# Altium schematic sheet RF.SchDoc
size A4; SheetNumber: 4; SheetTotal: 4
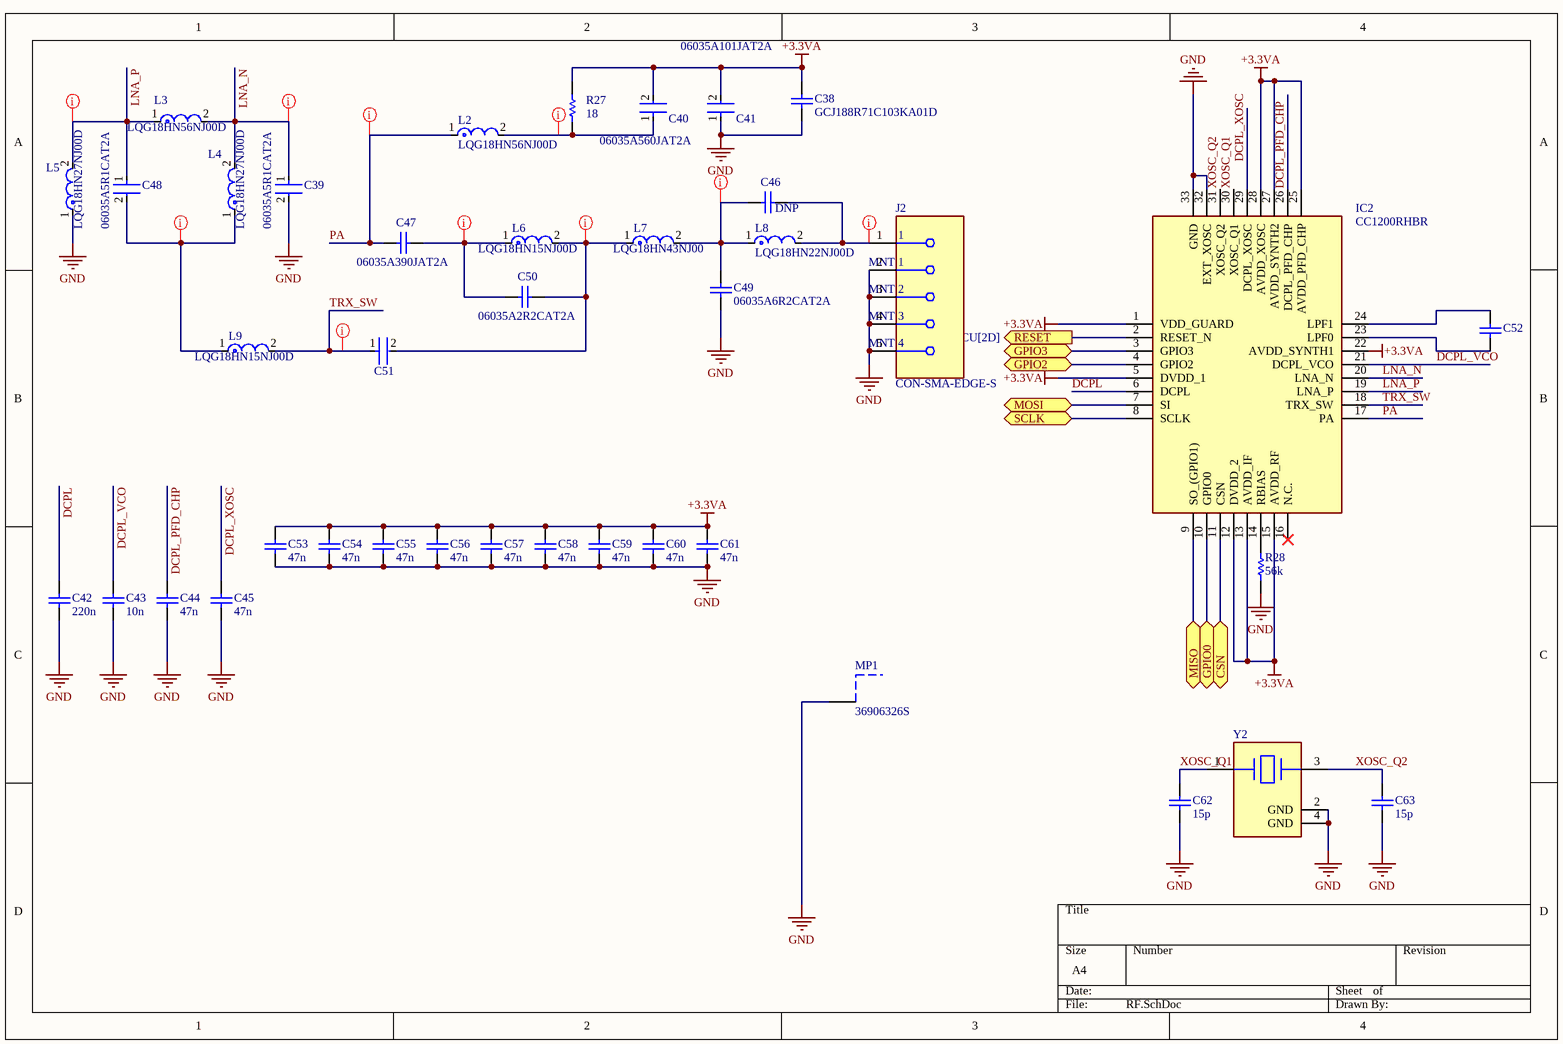
[diagram p0: RF.SchDoc]

## Parts
C38  GCJ188R71C103KA01D  [CAPC1608X90X35LL10T15]
C39  06035A5R1CAT2A  [FP-GCM188-0_1-IPC_A]
C40  06035A560JAT2A  [FP-GCM188-0_1-IPC_A]
C41  06035A101JAT2A  [FP-GCM188-0_1-IPC_A]
C42  value 220n  [RES_0805]  (hidden comment: Capacitor)
C43  value 10n  [RES_0805]  (hidden comment: Capacitor)
C44  value 47n  [RES_0805]  (hidden comment: Capacitor)
C45  value 47n  [RES_0805]  (hidden comment: Capacitor)
C46  DNP  [CAPC1608X90X35LL15T15]
C47  06035A390JAT2A  [CAPC1608X90X35LL15T15]
C48  06035A5R1CAT2A  [FP-GCM188-0_1-IPC_A]
C49  06035A6R2CAT2A  [CAPC1608X90X35LL15T15]
C50  06035A2R2CAT2A  [CAPC1608X90X35LL15T15]
C51  06035A5R1CAT2A  [FP-GCM188-0_1-IPC_A]  (value not drawn)
C52  GCM188R71H152KA37D  [CAPC1608X90X35LL10T15]  (value not drawn)
C53  value 47n  [RES_0805]  (hidden comment: Capacitor)
C54  value 47n  [RES_0805]  (hidden comment: Capacitor)
C55  value 47n  [RES_0805]  (hidden comment: Capacitor)
C56  value 47n  [RES_0805]  (hidden comment: Capacitor)
C57  value 47n  [RES_0805]  (hidden comment: Capacitor)
C58  value 47n  [RES_0805]  (hidden comment: Capacitor)
C59  value 47n  [RES_0805]  (hidden comment: Capacitor)
C60  value 47n  [RES_0805]  (hidden comment: Capacitor)
C61  value 47n  [RES_0805]  (hidden comment: Capacitor)
C62  value 15p  [RES_0805]  (hidden comment: Capacitor)
C63  value 15p  [RES_0805]  (hidden comment: Capacitor)
IC2  CC1200RHBR  [QFN50P500X500X100-33N-D]
J2  CON-SMA-EDGE-S  [FP-CON-SMA-EDGE-S-MFG]
L2  LQG18HN56NJ00D  [FP-LQG18HH_00-IPC_A]
L3  LQG18HN56NJ00D  [FP-LQG18HH_00-IPC_A]
L4  LQG18HN27NJ00D  [FP-LQG18HH_00-MFG]
L5  LQG18HN27NJ00D  [FP-LQG18HH_00-MFG]
L6  LQG18HN15NJ00D  [FP-LQG18HH_00-IPC_C]
L7  LQG18HN43NJ00  [FP-LQG18HH_00-IPC_C]
L8  LQG18HN22NJ00D  [FP-LQG18HH_00-IPC_C]
L9  LQG18HN15NJ00D  [FP-LQG18HH_00-IPC_C]
MP1  36906326S  [36906326S]
R27  value 18  [RES_0805]  (hidden comment: Resistor)
R28  value 56k  [RES_0805]  (hidden comment: Resistor)
Y2  NX3225SA-40.000MHZ-STD-CSR-1 NDK  [FP-ABM8G-MFG]  (value not drawn)

## Ports
CSN (bidir, see MCU[2D]), GPIO0 (bidir, see MCU[2D]), GPIO2 (bidir, see MCU[2D]), GPIO3 (bidir, see MCU[2D]), MISO (bidir, see MCU[2D]), MOSI (bidir, see MCU[2D]), RESET (out, see MCU[2D]), SCLK (bidir, see MCU[2D])

## Nets
+3.3VA: C38.2 C40.2 C41.2 C53.1 C54.1 C55.1 C56.1 C57.1 C58.1 C59.1 C60.1 C61.1 IC2.1(VDD_GUARD) IC2.5(DVDD_1) IC2.12(DVDD_2) IC2.13(AVDD_IF) IC2.15(AVDD_RF) IC2.22(AVDD_SYNTH1) IC2.25(AVDD_PFD_CHP) IC2.27(AVDD_SYNTH2) IC2.28(AVDD_XOSC) R27.1
GND: C38.1 C39.2 C41.1 C42.2 C43.2 C44.2 C45.2 C49.1 C53.2 C54.2 C55.2 C56.2 C57.2 C58.2 C59.2 C60.2 C61.2 C62.2 C63.2 IC2.32(EXT_XOSC) IC2.33(GND) J2.2(MNT_1) J2.3(MNT_2) J2.4(MNT_3) J2.5(MNT_4) L5.1 MP1.1 R28.2 Y2.2(GND) Y2.4(GND)
CSN: IC2.11(CSN) ; port CSN
DCPL: C42.1 IC2.6(DCPL)
DCPL_PFD_CHP: C44.1 IC2.26(DCPL_PFD_CHP)
DCPL_VCO: C43.1 IC2.21(DCPL_VCO)
DCPL_XOSC: C45.1 IC2.29(DCPL_XOSC)
GPIO0: IC2.10(GPIO0) ; port GPIO0
GPIO2: IC2.4(GPIO2) ; port GPIO2
GPIO3: IC2.3(GPIO3) ; port GPIO3
LNA_N: C39.1 IC2.20(LNA_N) L3.2 L4.2
LNA_P: C48.1 IC2.19(LNA_P) L3.1 L5.2
MISO: IC2.9(SO_(GPIO1)) ; port MISO
MOSI: IC2.7(SI) ; port MOSI
PA: C47.2 IC2.17(PA) L2.1
RESET: IC2.2(RESET_N) ; port RESET
SCLK: IC2.8(SCLK) ; port SCLK
TRX_SW: C51.1 IC2.18(TRX_SW) L9.2
XOSC_Q1: C62.1 IC2.30(XOSC_Q1) Y2.1
XOSC_Q2: C63.1 IC2.31(XOSC_Q2) Y2.3
NetC40_1: C40.1 L2.2 R27.2
NetC46_1: C46.1 J2.1 L8.2
NetC46_2: C46.2 C49.2 L7.2 L8.1
NetC47_1: C47.1 C50.2 L6.1
NetC48_2: C48.2 L4.1 L9.1
NetC50_1: C50.1 C51.2 L6.2 L7.1
NetC52_1: C52.1 IC2.23(LPF0)
NetC52_2: C52.2 IC2.24(LPF1)
NetIC2_14: IC2.14(RBIAS) R28.1

Not connected (* = marked no-connect by the designer): IC2 16(N.C.)*

## Layout directives
net class 50ohm: LNA_N, LNA_P, NetC40_1, NetC46_1, NetC46_2, NetC47_1, NetC48_2, NetC50_1, PA, TRX_SW

## Library data of the parts
C38 = CMP-2000-06338-1: Cap Ceramic 0.01uF 16V X7R 10% Pad SMD 0603 Soft Termination 125C Automotive T/R; Manufacturer: Murata; Capacitance: 10nF; Mounting Technology: SurfaceMount; Tolerance (%): ±10%; Case Size/Dimension: 0603; Datasheet URL: http://search.murata.co.jp/Ceramy/image/img/A01X/G101/ENG/GRM188R71C103KA01-01.pdf; Rated Voltage: 16V; Datasheet Version: 02/2016; Dielectric: X7R; Manufacturer URL: http://www.murata.com/; Package Reference: 0603; Package Description: 2-Pin Surface Mount Device, Body 1.6 x 0.8 mm
C39 C48 C51 = CMP-06035-052280-1: 0603 5.1 pF 50 V ±0.25 pF Tolerance C0G/NP0 Multilayer Ceramic Capacitor
C40 = CMP-06035-052280-1: 0603 56 pF 50 V ±5% Tolerance C0G/NP0 Surface Mount Multilayer Ceramic Capacitor
C41 = CMP-06035-052280-1: 0603 100 pF 50 V ±5% Tolerance C0G/NP0 SMT Multilayer Ceramic Capacitor
C42-C45 C53-C63 = Capacitor: SimulationGenericComponent: True
C46 C47 = CMP-2006-04354-1: Part Number: 06035A6R2CAT2A; Manufacturer: AVX Interconnect / Elco
C49 = CMP-2006-04354-1: Manufacturer: AVX Interconnect / Elco; Part Number: 06035A6R2CAT2A
C50 = CMP-2006-04354-1: 0603 2.2 pF 50 V ±0.25 pF Tolerance C0G/NP0 SMT Multilayer Ceramic Capacitor; Part Number: 06035A6R2CAT2A; Manufacturer: AVX Interconnect / Elco
C52 = CMP-2006-02377-1: Manufacturer: Murata; Part Number: GCM188R71H152KA37D
IC2 = CC1200RHBR: Integrated Circuit; Manufacturer_Name: Texas Instruments; Datasheet Link: http://www.ti.com/lit/gpn/cc1200; Height: 1mm; Manufacturer_Part_Number: CC1200RHBR; Mouser Part Number: 595-CC1200RHBR; Mouser Price/Stock: https://www.mouser.co.uk/ProductDetail/Texas-Instruments/CC1200RHBR?qs=R6c3TimDHSkfQr3ZZbsbuA%3D%3D; Arrow Part Number: CC1200RHBR; Arrow Price/Stock: https://www.arrow.com/en/products/cc1200rhbr/texas-instruments
J2 = CMP-204357-000001-1: CONN SMA JACK STR EDGE MNT; Manufacturer: RF Solutions Ltd.; Impedance: 50Ω; Conn Orientation: Right Angle; Is Female: yes; Number Of Contacts: 1; Frequency: 18GHz; Shielding: true; Category: Conn; ComponentLink2URL: https://www.rfsolutions.co.uk/downloads/1498648656DS-CON-EDGE-SMA-4.pdf; Octopart: https://octopart.com/con-sma-edge-s-rf+solutions-70967450; Package: CONN_JACK; Manufacturer Part Number: CON-SMA-EDGE-S; Height: 6.35mm; Device Class L1: Connectors; Footprint Url: https://forum.upverter.com/uploads/default/original/3X/b/e/be75b907af57498775929d6d9099689c472e0307.pdf; Contact Material: Gold; ComponentLink2Description: Datasheet; Device Class L2: RF / Coaxial Connectors; RoHS: TRUE; Device Class L3: unset; Digikey Description: CONN SMA JACK STR EDGE MNT; Lead Free: Yes; Automotive: No
L2 L3 = CMP-06042-002204-1: Multilayer type RF Inductor 56nH ±5% 0.75Ω 400mA 0603; DC Current: 300mA; DC Resistance (DCR): 750mR; Self Resonant Frequency: 1.1GHz; Test Frequency: 100MHz; Shielding: Unshielded; Q Factor: 12; Core Material: Air; Width: 0.031inch; Case Code (Metric): 1608; Inductance: 56nH; Mount: Surface Mount; Depth: 0.95mm; Max DC Current: 300mA; Case/Package: 0603; Length: 1.75mm; Case Code (Imperial): 0603; Military Standard: Not; Min Operating Temperature: -40°C; Lead Free: Lead Free; Packaging: Tape and Reel; Radiation Hardening: No; Max Operating Temperature: 85°C; Termination: SMD/SMT; Tolerance: 5%; Current Rating: 300mA; Package Quantity: 1; Height: 0.031inch
L4 L5 = CMP-06042-005497-1: Multilayer type RF Inductor 27nH ±5% 0.54Ω 500mA 0603; Q Factor: 12; Shielding: Unshielded; Max DC Current: 300mA; Self Resonant Frequency: 2GHz; Test Frequency: 100MHz; Core Material: Air; DC Resistance (DCR): 550mR; Min Operating Temperature: -55°C; Max Operating Temperature: 85°C; Tolerance: 5%; Depth: 0.95mm; Case Code (Imperial): 0603; Package Quantity: 4000; Lead Free: Lead Free; Height: 0.8mm; Radiation Hardening: No; Case/Package: 0603; Mount: Surface Mount; DC Current: 300mA; Length: 0.063inch; Inductance Tolerance: 5%; Military Standard: Not; Termination: SMD/SMT; Packaging: Tape and Reel; Current Rating: 300mA; Inductance: 27nH; Case Code (Metric): 1608; Width: 0.8mm; REACH SVHC: No SVHC; Height - Seated (Max): 0.037inch
L6 L9 = CMP-06042-008636-1: Multilayer type RF Inductor 15nH ±5% 0.35Ω 600mA 0603; Q Factor: 12; Current Rating: 350mA; Core Material: Air; Shielding: Unshielded; Test Frequency: 100MHz; Self Resonant Frequency: 2.8GHz; DC Resistance (DCR): 400mR; Case Code (Imperial): 0603; Width: 0.031inch; Inductance: 15nH; REACH SVHC: No SVHC; Min Operating Temperature: -40°C; Mount: Surface Mount; Height: 0.031inch; Max Operating Temperature: 85°C; DC Current: 350mA; Lead Free: Lead Free; Depth: 0.95mm; Package Quantity: 4000; Radiation Hardening: No; Case Code (Metric): 1608; Termination: SMD/SMT; Inductance Tolerance: 5%; Military Standard: Not; Length: 0.063inch; Packaging: Tape and Reel; Case/Package: 0603; Max DC Current: 350mA; Tolerance: 5%
L7 = CMP-06042-008636-1: Multilayer type RF Inductor 43nH ±5%0603; Q Factor: 12; Current Rating: 350mA; Inductance: 15nH; Core Material: Air; Shielding: Unshielded; Test Frequency: 100MHz; Self Resonant Frequency: 2.8GHz; DC Resistance (DCR): 400mR; Inductance Tolerance: 5%; Case Code (Imperial): 0603; Width: 0.031inch; REACH SVHC: No SVHC; Min Operating Temperature: -40°C; Mount: Surface Mount; Height: 0.031inch; Max Operating Temperature: 85°C; DC Current: 350mA; Lead Free: Lead Free; Depth: 0.95mm; Package Quantity: 4000; Radiation Hardening: No; Case Code (Metric): 1608; Termination: SMD/SMT; Military Standard: Not; Length: 0.063inch; Packaging: Tape and Reel; Case/Package: 0603; Max DC Current: 350mA; Tolerance: 5%
L8 = CMP-06042-016460-1: Multilayer type RF Inductor 22nH ±5% 0.5Ω 500mA 0603; Current Rating: 300mA; Core Material: Air; Shielding: Unshielded; Self Resonant Frequency: 2.3GHz; Test Frequency: 100MHz; Q Factor: 12; DC Resistance (DCR): 500mR; Max Operating Temperature: 85°C; RoHS Compliant: Yes; Termination: SMD/SMT; Max DC Current: 300mA; Min Operating Temperature: -40°C; Height - Seated (Max): 0.037inch; Inductance: 22nH; Length: 1.6mm; REACH SVHC: No SVHC; Package Quantity: 4000; Tolerance: 5%; Depth: 0.95mm; Mount: Surface Mount; Packaging: Tape and Reel; Military Standard: Not; DC Current: 300mA; Case Code (Metric): 1608; Lead Free: Lead Free; Case Code (Imperial): 0603; Inductance Tolerance: 5%; Width: 0.031inch; Case/Package: 0603; Height: 0.8mm; Radiation Hardening: No; Series: LQG18H
MP1 = CMP-03913-78870950-1: 36906326S WE-SHC Shielding Cabinet; Core Material: Steel; Min Operating Temperature: -40°C; Length: 31.6mm; Height: 5.8mm; RoHS: Compliant; Max Operating Temperature: 125°C; NexarPartId: 78870950; Width: 31.6mm
R27 R28 = Resistor: TC1: 0; SimulationGenericComponent: True; TC2: 0
Y2 = CMP-27762-015223-1: Parallel - Fundamental Quartz Crystal, 40MHz Nom; ESR (Equivalent Series Resistance): 50R; Tolerance: 20ppm; Frequency Stability: 30ppm; Load Capacitance: 18pF; Radiation Hardening: No; Max Operating Temperature: 85°C; Termination: SMD/SMT; Height: 0.039inch; Packaging: Tape and Reel; Mount: Surface Mount; Min Operating Temperature: -40°C; Length: 3.2mm; Depth: 2.5mm; Series: ABM8G; Package Quantity: 1000; Width: 0.098inch; Series Resistance: 50R; Case/Package: CSMD; Frequency: 40MHz; Frequency Tolerance: 20ppm; Number of Pins: 4